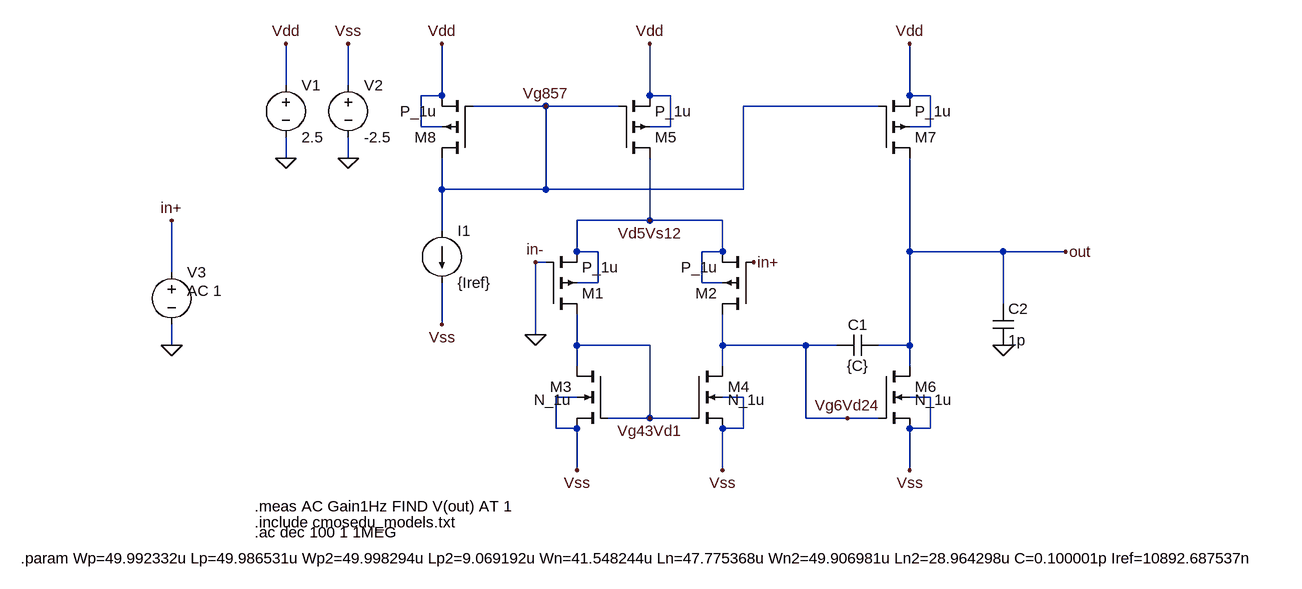
[diagram p0: schematic otimoValores.asc]
otimoValores.asc, the LTspice schematic file:
Version 4
SHEET 1 1384 680
WIRE -288 -80 -288 -144
WIRE -192 -80 -192 -144
WIRE -48 -64 -48 -144
WIRE -48 -64 -80 -64
WIRE 272 -64 272 -144
WIRE 304 -64 272 -64
WIRE 672 -64 672 -144
WIRE 704 -64 672 -64
WIRE 112 -48 0 -48
WIRE 224 -48 112 -48
WIRE 528 -48 416 -48
WIRE 624 -48 528 -48
WIRE -80 -16 -80 -64
WIRE -48 -16 -80 -16
WIRE 304 -16 304 -64
WIRE 304 -16 272 -16
WIRE 704 -16 704 -64
WIRE 704 -16 672 -16
WIRE -288 32 -288 0
WIRE -192 32 -192 0
WIRE -48 80 -48 32
WIRE 112 80 112 -48
WIRE 112 80 -48 80
WIRE 416 80 416 -48
WIRE 416 80 112 80
WIRE 672 80 672 32
WIRE 272 128 272 32
WIRE 272 128 160 128
WIRE 384 128 272 128
WIRE -48 144 -48 80
WIRE 160 160 160 128
WIRE 160 176 160 160
WIRE 192 176 160 176
WIRE 384 176 384 128
WIRE 384 176 352 176
WIRE 672 176 672 80
WIRE 816 176 672 176
WIRE 912 176 816 176
WIRE 112 192 96 192
WIRE -464 208 -464 128
WIRE 192 224 192 176
WIRE 192 224 160 224
WIRE 352 224 352 176
WIRE 384 224 352 224
WIRE 816 256 816 176
WIRE -48 288 -48 224
WIRE 160 288 160 272
WIRE 384 288 384 272
WIRE 672 288 672 176
WIRE 96 304 96 192
WIRE -464 320 -464 288
WIRE 160 320 160 288
WIRE 272 320 160 320
WIRE 384 320 384 288
WIRE 512 320 384 320
WIRE 560 320 512 320
WIRE 672 320 672 288
WIRE 672 320 624 320
WIRE 160 352 160 320
WIRE 384 352 384 320
WIRE 512 352 512 320
WIRE 672 352 672 320
WIRE 160 400 128 400
WIRE 416 400 384 400
WIRE 704 400 672 400
WIRE 272 432 272 320
WIRE 272 432 208 432
WIRE 304 432 272 432
WIRE 336 432 304 432
WIRE 512 432 512 352
WIRE 576 432 512 432
WIRE 624 432 576 432
WIRE 128 448 128 400
WIRE 160 448 128 448
WIRE 416 448 416 400
WIRE 416 448 384 448
WIRE 704 448 704 400
WIRE 704 448 672 448
WIRE 160 512 160 448
WIRE 384 512 384 448
WIRE 672 512 672 448
FLAG -48 -144 Vdd
FLAG 272 -144 Vdd
FLAG 672 -144 Vdd
FLAG 96 192 in-
FLAG -48 288 Vss
FLAG 384 512 Vss
FLAG 672 512 Vss
FLAG 160 512 Vss
FLAG -288 32 0
FLAG -192 32 0
FLAG -288 -144 Vdd
FLAG -192 -144 Vss
FLAG -464 128 in+
FLAG -464 320 0
FLAG 816 320 0
FLAG 912 176 out
FLAG 96 304 0
FLAG 432 192 in+
FLAG 112 -48 Vg857
FLAG 272 432 Vg43Vd1
FLAG 576 432 Vg6Vd24
FLAG 272 128 Vd5Vs12
DATAFLAG 384 288 ""
DATAFLAG 304 432 ""
DATAFLAG 672 288 ""
DATAFLAG 512 352 ""
DATAFLAG 160 160 ""
DATAFLAG 160 288 ""
DATAFLAG 528 -48 ""
DATAFLAG 672 80 ""
SYMBOL current -48 144 R0
WINDOW 123 0 0 Left 2
WINDOW 39 0 0 Left 2
SYMATTR InstName I1
SYMATTR Value {Iref}
SYMBOL nmos4 208 352 M0
WINDOW 3 56 52 Left 2
SYMATTR Value N_1u
SYMATTR InstName M3
SYMATTR Value2 l={Ln} w={Wn}
SYMBOL cap 560 304 M90
WINDOW 0 0 32 VBottom 2
WINDOW 3 32 32 VTop 2
SYMATTR InstName C1
SYMATTR Value {C}
SYMBOL voltage -288 -96 R0
WINDOW 123 24 44 Left 2
WINDOW 39 0 0 Left 2
SYMATTR InstName V1
SYMATTR Value 2.5
SYMBOL voltage -192 -96 R0
WINDOW 123 24 44 Left 2
WINDOW 39 0 0 Left 2
SYMATTR InstName V2
SYMATTR Value -2.5
SYMBOL voltage -464 192 R0
WINDOW 123 24 44 Left 2
WINDOW 39 0 0 Left 2
WINDOW 3 24 44 Left 2
SYMATTR Value2 AC 1
SYMATTR Value ""
SYMATTR InstName V3
SYMBOL cap 800 256 R0
SYMATTR InstName C2
SYMATTR Value 1p
SYMBOL pmos4 112 272 M180
SYMATTR InstName M1
SYMATTR Value2 l={Lp2} w={Wp2}
SYMATTR Value P_1u
SYMBOL nmos4 336 352 R0
WINDOW 3 56 52 Left 2
SYMATTR Value N_1u
SYMATTR InstName M4
SYMATTR Value2 l={Ln} w={Wn}
SYMBOL nmos4 624 352 R0
WINDOW 3 56 52 Left 2
SYMATTR Value N_1u
SYMATTR InstName M6
SYMATTR Value2 l={Ln2} w={Wn2}
SYMBOL pmos4 432 272 R180
SYMATTR InstName M2
SYMATTR Value2 l={Lp2} w={Wp2}
SYMATTR Value P_1u
SYMBOL pmos4 624 32 M180
SYMATTR InstName M7
SYMATTR Value2 l={Lp} w={Wp}
SYMATTR Value P_1u
SYMBOL pmos4 224 32 M180
SYMATTR InstName M5
SYMATTR Value2 l={Lp} w={Wp}
SYMATTR Value P_1u
SYMBOL pmos4 0 32 R180
SYMATTR InstName M8
SYMATTR Value2 l={Lp} w={Wp}
SYMATTR Value P_1u
TEXT -336 608 Left 2 !.ac dec 100 1 1MEG
TEXT -336 592 Left 2 !.include cmosedu_models.txt
TEXT -336 568 Left 2 !.meas AC Gain1Hz FIND V(out) AT 1
TEXT -696 648 Left 2 !.param Wp=49.992332u Lp=49.986531u Wp2=49.998294u Lp2=9.069192u Wn=41.548244u Ln=47.775368u Wn2=49.906981u Ln2=28.964298u C=0.100001p Iref=10892.687537n

The netlist it stands for:
* otimoValores.asc
I1 Vg857 Vss {Iref}
M3 Vg43Vd1 Vg43Vd1 Vss Vss N_1u l={Ln} w={Wn}
C1 Vg6Vd24 out {C}
V1 Vdd 0 2.5
V2 Vss 0 -2.5
V3 in+ 0 AC 1
C2 out 0 1p
M1 Vg43Vd1 0 Vd5Vs12 Vd5Vs12 P_1u l={Lp2} w={Wp2}
M4 Vg6Vd24 Vg43Vd1 Vss Vss N_1u l={Ln} w={Wn}
M6 out Vg6Vd24 Vss Vss N_1u l={Ln2} w={Wn2}
M2 Vg6Vd24 in+ Vd5Vs12 Vd5Vs12 P_1u l={Lp2} w={Wp2}
M7 out Vg857 Vdd Vdd P_1u l={Lp} w={Wp}
M5 Vd5Vs12 Vg857 Vdd Vdd P_1u l={Lp} w={Wp}
M8 Vg857 Vg857 Vdd Vdd P_1u l={Lp} w={Wp}
.model NMOS NMOS
.model PMOS PMOS
.lib standard.mos
.ac dec 100 1 1MEG
.include cmosedu_models.txt
.meas AC Gain1Hz FIND V(out) AT 1
.param Wp=49.992332u Lp=49.986531u Wp2=49.998294u Lp2=9.069192u Wn=41.548244u Ln=47.775368u Wn2=49.906981u Ln2=28.964298u C=0.100001p Iref=10892.687537n
.backanno
.end